# EAGLE design heating-controller (EAGLE 6.4)
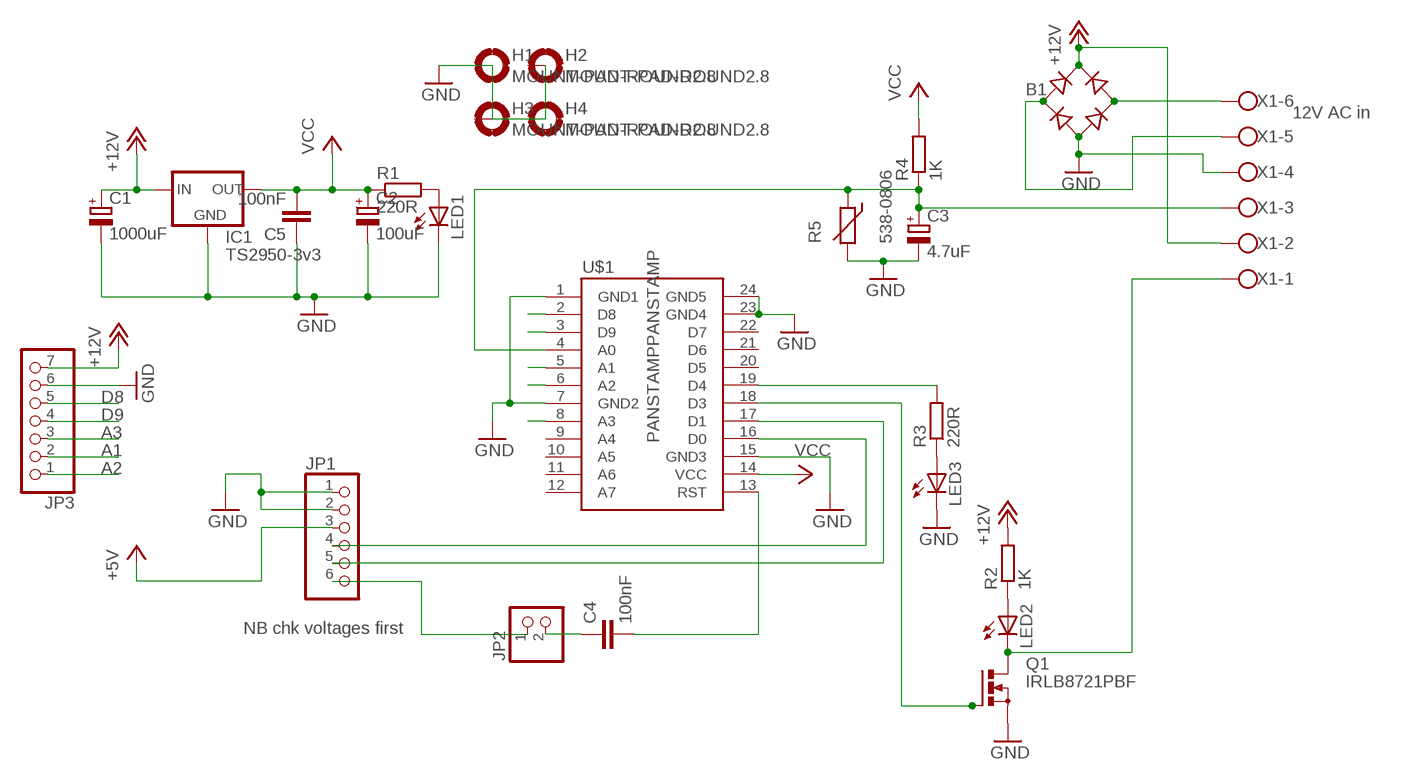
[diagram p0: schematic, sheet 1]

## Parts
B1  B-DIL  [B-DIL]
C1  1000uF  CPOL-EUE3.5-10  [E3,5-10]
C2  100uF  CPOL-EUE3.5-10  [E3,5-10]
C3  4.7uF  CPOL-EUE3.5-10  [E3,5-10]
C4  100nF  C-EU050-024X044  [C050-024X044]
C5  100nF  C-EU050-024X044  [C050-024X044]
H1  MOUNT-PAD-ROUND2.8  [2,8-PAD]
H2  MOUNT-PAD-ROUND2.8  [2,8-PAD]
H3  MOUNT-PAD-ROUND2.8  [2,8-PAD]
H4  MOUNT-PAD-ROUND2.8  [2,8-PAD]
IC1  TS2950-3v3  LP2950ACZ-3.0  [TO92]
JP1  PINHD-1X6  [1X06]
JP2  PINHD-1X2  [1X02]
JP3  PINHD-1X7  [1X07]
LED1  LED3MM  [LED3MM]
LED2  LED3MM  [LED3MM]
LED3  LED3MM  [LED3MM]
Q1  IRLB8721PBF  PMOSFET_NTO220BV  [TO220BV]
R1  220R  R-EU_0207/7  [0207/7]
R2  1K  R-EU_0207/7  [0207/7]
R3  220R  R-EU_0207/7  [0207/7]
R4  1K  R-EU_0207/7  [0207/7]
R5  538-0806  THERMISTOR-2,5  [RS-2,5]
U$1  PANSTAMPPANSTAMP  [DIL24-6]
X1  W237-6  [W237-6]

## Nets
+5V: JP1.3
+12V: B1.+ C1.+ IC1.3(IN) JP3.7 R2.2 X1.2
A1: JP3.2 U$1.5(A1)
A2: JP3.1 U$1.6(A2)
A3: JP3.3 U$1.8(A3)
D8: JP3.5 U$1.2(D8)
D9: JP3.4 U$1.3(D9)
GND: B1.- C1.- C2.- C3.- C5.1 IC1.2(GND) JP1.1 JP1.2 JP3.6 LED1.K(C) LED3.K(C) Q1.S R5.2 U$1.1(GND1) U$1.7(GND2) U$1.15(GND3) U$1.23(GND4) U$1.24(GND5) X1.4
N$1: C3.+ R4.1 R5.1 U$1.4(A0) X1.3
N$2: R3.2 U$1.19(D4)
N$3: LED2.K(C) Q1.D X1.1
N$4: LED1.A R1.2
N$5: LED2.A R2.1
N$6: LED3.A R3.1
N$7: Q1.G U$1.18(D3)
N$8: C4.1 JP2.2
N$9: JP1.4 U$1.16(D0)
N$10: JP1.5 U$1.17(D1)
N$11: B1.AC1 X1.6
N$12: JP1.6 JP2.1
N$13: B1.AC2 X1.5
N$14: C4.2 U$1.13(RST)
VCC: C2.+ C5.2 IC1.1(OUT) R1.1 R4.2 U$1.14(VCC)
Unconnected: H1.B2,8(MOUNT) H2.B2,8(MOUNT) H3.B2,8(MOUNT) H4.B2,8(MOUNT) U$1.9(A4) U$1.10(A5) U$1.11(A6) U$1.12(A7) U$1.20(D5) U$1.21(D6) U$1.22(D7)

## Notes on the sheet
- 12V AC in
- NB chk voltages first

## Library data of the parts
B1 = rectifier:B-DIL: RECTIFIER
C1-C3 = rcl:CPOL-EU: POLARIZED CAPACITOR, European symbol
C4 C5 = rcl:C-EU: CAPACITOR, European symbol
H1-H4 = holes:MOUNT-PAD-ROUND: MOUNTING PAD, round
IC1 = v-reg:LP2950?*: Source: http://cache.national.com/ds/LP/LP2950.pdf
JP1 = pinhead:PINHD-1X6: PIN HEADER
JP2 = pinhead:PINHD-1X2: PIN HEADER
JP3 = pinhead:PINHD-1X7: PIN HEADER
LED1-LED3 = led:LED: LED OSRAM: - CHIPLED LG R971, LG N971, LY N971, LG Q971, LY Q971, LO R971, LY R971 LH N974, LH R974 LS Q976, LO Q976, LY Q976 LO Q996 - Hyper CHIPLED LW Q18S LB Q993, LB Q99A, LB R99A - SideLED LS A670, LO A670, LY A670, LG A670, LP A670 LB A673, LV A673, LT A673, LW A673 LH A674 LY A675 LS A676, LA A676, LO A676, LY A676, LW A676 LS A679, LY A679, LG A679 - Hyper Micro SIDELED® LS Y876, LA Y876, LO Y876, LY Y876 LT Y87S - SmartLED LW L88C, LW L88S LB L89C, LB L89S, LG L890 LS L89K, LO L89K, LY L89K LS L896, LA L896, LO L896, LY L896 - TOPLED LS T670, LO T670, LY T670, LG T670, LP T670 LSG T670, LSP T670, LSY T670, LOP T670, LYG T670 LG T671, LOG T671, LSG T671 LB T673, LV T673, LT T673, LW T673 LH T674 LS T676, LA T676, LO T676, LY T676, LB T676, LH T676, LSB T676, LW T676 LB T67C, LV T67C, LT T67C, LS T67K, LO T67K, LY T67K, LW E67C LS E67B, LA E67B, LO E67B, LY E67B, LB E67C, LV E67C, LT E67C LW T67C LS T679, LY T679, LG T679 LS T770, LO T770, LY T770, LG T770, LP T770 LB T773, LV T773, LT T773, LW T773 LH T774 LS E675, LA E675, LY E675, LS T675 LS T776, LA T776, LO T776, LY T776, LB T776 LHGB T686 LT T68C, LB T68C - Hyper Mini TOPLED® LB M676 - Mini TOPLED Santana® LG M470 LS M47K, LO M47K, LY M47K Source: http://www.osram.convergy.de LUXEON: - LUMILED® LXK2-PW12-R00, LXK2-PW12-S00, LXK2-PW14-U00, LXK2-PW14-V00 LXK2-PM12-R00, LXK2-PM12-S00, LXK2-PM14-U00 LXK2-PE12-Q00, LXK2-PE12-R00, LXK2-PE12-S00, LXK2-PE14-T00, LXK2-PE14-U00 LXK2-PB12-K00, LXK2-PB12-L00, LXK2-PB12-M00, LXK2-PB14-N00, LXK2-PB14-P00, LXK2-PB14-Q00 LXK2-PR12-L00, LXK2-PR12-M00, LXK2-PR14-Q00, LXK2-PR14-R00 LXK2-PD12-Q00, LXK2-PD12-R00, LXK2-PD12-S00 LXK2-PH12-R00, LXK2-PH12-S00 LXK2-PL12-P00, LXK2-PL12-Q00, LXK2-PL12-R00 Source: www.luxeon.com KINGBRIGHT: KA-3528ASYC Source: www.kingbright.com
Q1 = transistor-power:PMOSFET_N: Power MOSFET N-Channel
R1-R4 = rcl:R-EU_: RESISTOR, European symbol
R5 = varistor:THERMISTOR: THERMISTOR
U$1 = panstamp:PANSTAMP: Panstamp wireless module
X1 = con-wago-500:W237-6: WAGO SCREW CLAMP; OC_FARNELL: unknown; OC_NEWARK: unknown

## Board
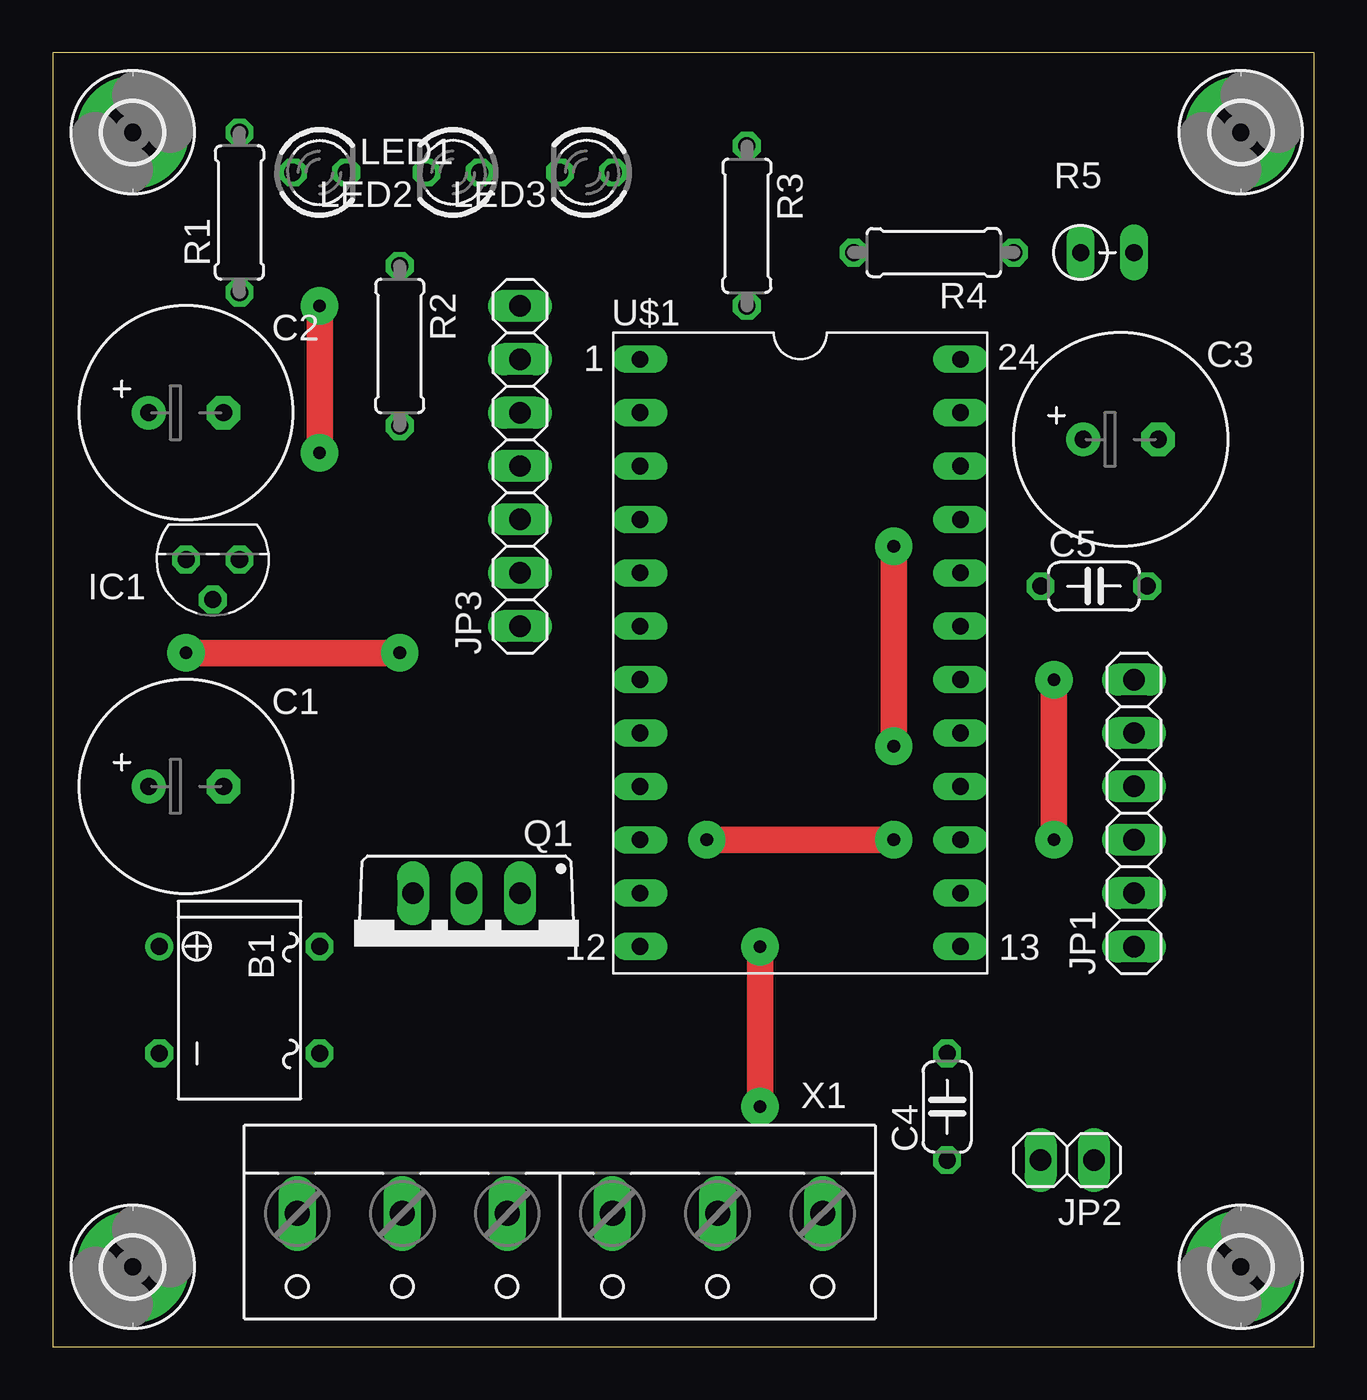
[diagram p1: board, top side]
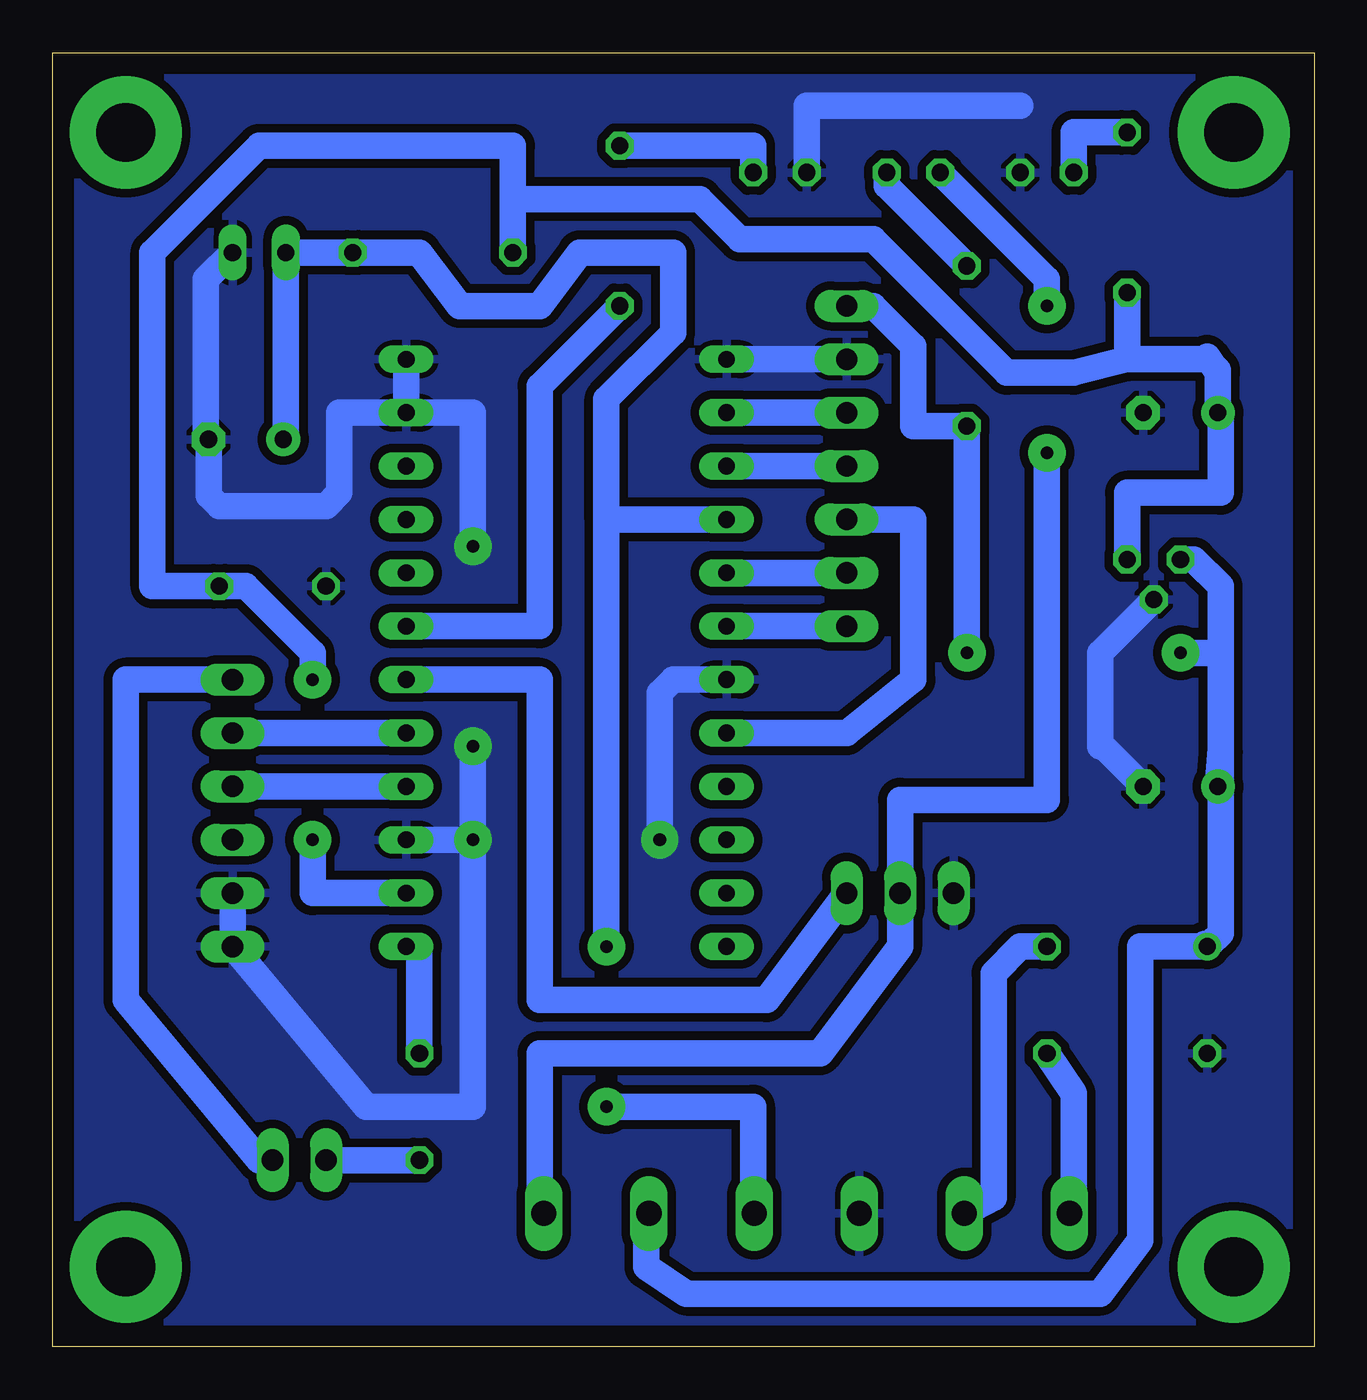
[diagram p2: board, bottom side, seen from below]

Size 59.99 x 61.59 mm. Coordinates in mm from the lower left corner, seen from the top.
Outline: 0,0 59.99,0 59.99,61.59 0,61.59 0,0
Copper layers (1*16): Top 0.035mm / dielectric 1.5mm / Bottom 0.035mm
Design rules "default *": minimum track width 10mil, minimum drill 24mil, track to track 16mil, track to pad 16mil, pad to pad 16mil, via to via 16mil, smd to smd 16mil, copper to edge 40mil, drill to drill 8mil, minimum pad ring 10mil, minimum via ring 8mil, stop-mask expansion 4mil, vias tented up to drill 0mil, thermal gap 10mil

### Footprints (pad centres in the part's own frame; a part is rotated, then mirrored left to right if it is on the bottom)
B-DIL = drill 0.813: + -2.54,-3.81 | drill 0.813 octagon: - 2.54,-3.81; AC1 2.54,3.81; AC2 -2.54,3.81
E3,5-10 = drill 0.813 pad 1.6: + -1.778,0 | drill 0.813 pad 1.6 octagon: - 1.778,0
C050-024X044 = drill 0.813 octagon: 1 -2.54,0; 2 2.54,0
2,8-PAD = drill 2.8 pad 5.334: B2,8 0,0
TO92 = drill 0.813 octagon: 1 -1.27,0; 2 0,1.905; 3 1.27,0
1X06 = drill 1.016 long: 1 -6.35,0; 2 -3.81,0; 3 -1.27,0; 4 1.27,0; 5 3.81,0; 6 6.35,0
1X02 = drill 1.016 long: 1 -1.27,0; 2 1.27,0
1X07 = drill 1.016 long: 1 -7.62,0; 2 -5.08,0; 3 -2.54,0; 4 0,0; 5 2.54,0; 6 5.08,0; 7 7.62,0
LED3MM = drill 0.813 octagon: A -1.27,0; K 1.27,0
TO220BV = drill 1.016 long: D 0,-2.54; G -2.54,-2.54; S 2.54,-2.54
0207/7 = drill 0.813 octagon: 1 -3.81,0; 2 3.81,0
RS-2,5 = drill 0.813 long: 1 -1.27,0; 2 1.27,0
DIL24-6 = drill 0.8 long: 1 -7.62,13.97; 2 -7.62,11.43; 3 -7.62,8.89; 4 -7.62,6.35; 5 -7.62,3.81; 6 -7.62,1.27; 7 -7.62,-1.27; 8 -7.62,-3.81; 9 -7.62,-6.35; 10 -7.62,-8.89; 11 -7.62,-11.43; 12 -7.62,-13.97; 13 7.62,-13.97; 14 7.62,-11.43; 15 7.62,-8.89; 16 7.62,-6.35; 17 7.62,-3.81; 18 7.62,-1.27; 19 7.62,1.27; 20 7.62,3.81; 21 7.62,6.35; 22 7.62,8.89; 23 7.62,11.43; 24 7.62,13.97
W237-6 = drill 1.194 long: 1 -12.5,-1.27; 2 -7.5,-1.27; 3 -2.5,-1.27; 4 2.5,-1.27; 5 7.5,-1.27; 6 12.5,-1.27

### Placement (x,y rotation side)
B1  8.89,16.51 270 top
C1  6.35,26.67 0 top
C2  6.35,44.45 0 top
C3  50.8,43.18 0 top
C4  42.55,11.43 90 top
C5  49.53,36.2 0 top
H1  3.81,3.81 0 top
H2  56.52,3.81 0 top
H3  3.81,57.78 0 top
H4  56.52,57.78 0 top
IC1  7.62,37.47 180 top
JP1  51.44,25.4 90 top
JP2  48.26,8.89 180 top
JP3  22.23,41.91 90 top
LED1  12.7,55.88 0 top
LED2  19.05,55.88 180 top
LED3  25.4,55.88 180 top
Q1  19.68,19.05 180 top
R1  8.89,53.98 90 top
R2  16.51,47.62 270 top
R3  33.02,53.34 270 top
R4  41.91,52.07 180 top
R5  50.16,52.07 0 top
U$1  35.56,33.02 0 top
X1  24.13,5.08 180 top

### Tracks (layer width: path | path; a pad name or v marks a point on that pad's centre or on a via)
+12V  (via drill 0.6 pad 1.78)
  Top 1.27: v16.51,33.02 v6.35,33.02
  Bottom 1.27: X1.2 31.75,6.35 31.75,3.81 29.84,2.54 10.16,2.54 8.26,5.08 8.26,19.05 B1.+ 5.21,19.18 4.95,19.18 4.45,19.68 4.45,28.45 | 4.45,28.45 C1.+ | 4.45,28.45 4.45,33.02 | 4.45,33.02 4.45,36.2 5.71,37.47 IC1.3 | v16.51,33.02 R2.2 19.05,43.81 19.05,47.62 20.95,49.53 JP3.7 | v6.35,33.02 4.45,33.02
A1
  Bottom 1.27: U$1.5 JP3.2
A2
  Bottom 1.27: U$1.6 JP3.1
A3
  Bottom 1.27: U$1.8 22.23,29.21 19.05,31.75 19.05,39.37 JP3.3
D8
  Bottom 1.27: U$1.2 JP3.5
D9
  Bottom 1.27: U$1.3 JP3.4
GND  (via drill 0.6 pad 1.78)
  Top 1.27: v31.11,24.13 v40.01,24.13 | v40.01,28.57 v40.01,38.1
  Bottom 1.27: v40.01,24.13 40.01,11.43 45.09,11.43 JP1.1 JP1.2 | U$1.24 U$1.23 | U$1.23 46.35,44.45 46.35,40.64 46.99,40.01 52.07,40.01 52.58,40.51 C3.- 52.7,43.31 52.7,50.8 R5.2 | U$1.7 30.48,31.75 31.11,31.11 v31.11,24.13 | U$1.15 v40.01,24.13 | v40.01,24.13 v40.01,28.57 | v40.01,38.1 40.01,44.45 U$1.23 | LED3.K 24.13,59.05 13.97,59.05 | U$1.1 JP3.6 | C1.- 10.03,28.57 10.16,28.57 10.16,33.02 IC1.2
  pour Bottom: -0.64,62.23 60.96,62.23 60.96,-0.64 -0.64,-0.64
N$1  (via drill 0.6 pad 1.78)
  Top 1.27: v33.66,19.05 v33.66,11.43
  Bottom 1.27: C3.+ 48.9,43.18 R5.1 R4.1 42.55,52.07 40.64,49.53 36.83,49.53 34.92,52.07 30.48,52.07 30.48,48.26 33.66,45.09 33.66,39.37 | U$1.4 33.66,39.37 | 33.66,39.37 v33.66,19.05 | v33.66,11.43 26.67,11.43 26.67,6.39 X1.3
N$2
  Bottom 1.27: R3.2 36.83,45.72 36.83,34.29 U$1.19
N$3  (via drill 0.6 pad 1.78)
  Top 1.27: v12.7,49.53 v12.7,42.55
  Bottom 1.27: X1.1 36.83,6.55 36.83,13.97 23.5,13.97 19.68,19.05 Q1.D 19.68,26.04 12.7,26.04 v12.7,42.55 | LED2.K 12.7,50.8 v12.7,49.53
N$4
  Bottom 1.27: LED1.A 11.43,57.78 R1.2
N$5
  Bottom 1.27: LED2.A 20.32,55.24 R2.1
N$6
  Bottom 1.27: LED3.A 26.67,57.15 R3.1
N$7
  Bottom 1.27: Q1.G 26.04,16.51 36.83,16.51 36.83,31.75 U$1.18
N$8
  Bottom 1.27: JP2.2 C4.1
N$9
  Bottom 1.27: U$1.16 JP1.4
N$10
  Bottom 1.27: U$1.17 JP1.5
N$11
  Bottom 1.27: X1.6 11.43,6.35 11.43,12.06 B1.AC1
N$12
  Bottom 1.27: JP1.6 56.52,31.75 56.52,16.51 50.16,8.89 JP2.1
N$13
  Bottom 1.27: B1.AC2 13.97,19.05 15.24,17.78 15.24,7.11 X1.5
N$14
  Bottom 1.27: C4.2 42.55,19.05 U$1.13
VCC  (via drill 0.6 pad 1.78)
  Top 1.27: v47.62,31.75 v47.62,24.13
  Bottom 1.27: R4.2 38.1,54.61 | 38.1,54.61 38.1,57.15 50.16,57.15 55.24,52.07 55.24,36.2 C5.2 50.8,36.2 47.62,33.02 v47.62,31.75 | 38.1,54.61 29.21,54.61 27.3,52.7 20.95,52.7 14.61,46.35 11.43,46.35 8.89,46.99 | 4.57,46.35 C2.+ 4.45,44.32 4.45,40.64 8.89,40.64 IC1.1 | 4.57,46.35 4.57,46.48 5.08,46.99 8.89,46.99 | 5.08,47.12 4.57,46.35 | R1.1 8.89,46.99 | U$1.14 47.62,21.59 v47.62,24.13